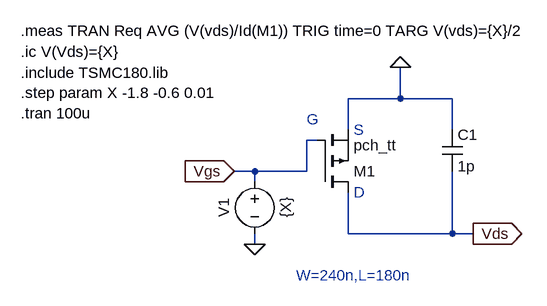
[diagram p0: schematic Prob_1b.asc]
Prob_1b.asc, the LTspice schematic file:
Version 4
SHEET 1 880 848
WIRE 32 560 32 512
WIRE 32 560 -48 560
WIRE 112 560 32 560
WIRE -48 608 -48 560
WIRE 112 608 112 560
WIRE -96 624 -112 624
WIRE -192 672 -224 672
WIRE -112 672 -112 624
WIRE -112 672 -192 672
WIRE -192 688 -192 672
WIRE -48 768 -48 704
WIRE 112 768 112 672
WIRE 112 768 -48 768
WIRE 144 768 112 768
WIRE -192 784 -192 768
FLAG -224 672 Vgs
IOPIN -224 672 In
FLAG -192 784 0
FLAG 32 512 0
FLAG 144 768 Vds
IOPIN 144 768 Out
SYMBOL voltage -192 672 R0
WINDOW 0 -32 56 VBottom 2
WINDOW 3 32 56 VTop 2
WINDOW 123 0 0 Left 0
WINDOW 39 0 0 Left 0
SYMATTR InstName V1
SYMATTR Value {X}
SYMBOL cap 96 608 R0
SYMATTR InstName C1
SYMATTR Value 1p
SYMBOL pmos -96 704 M180
SYMATTR InstName M1
SYMATTR Value pch_tt
SYMATTR Value2 W=240n, L=180n
TEXT -552 520 Left 2 !.include TSMC180.lib\n.step param X -1.8 -0.6 0.01\n.tran 100u
TEXT -552 488 Left 2 !.ic V(Vds)={X}
TEXT -552 456 Left 2 !.meas TRAN Req AVG (V(vds)/Id(M1)) TRIG time=0 TARG V(vds)={X}/2
TEXT -128 832 Left 2 ;W=240n,L=180n
TEXT -112 592 Left 2 ;G
TEXT -40 608 Left 2 ;S
TEXT -40 704 Left 2 ;D

The netlist it stands for:
* Prob_1b.asc
V1 Vgs 0 {X}
C1 0 Vds 1p
M1 Vds Vgs 0 0 pch_tt W=240n, L=180n
.model NMOS NMOS
.model PMOS PMOS
.lib standard.mos
.include TSMC180.lib
.step param X -1.8 -0.6 0.01
.tran 100u
.ic V(Vds)={X}
.meas TRAN Req AVG (V(vds)/Id(M1)) TRIG time=0 TARG V(vds)={X}/2
* W=240n,L=180n
* G
* S
* D
.backanno
.end

* Results of the author's LTspice run, read from the files saved beside the schematic
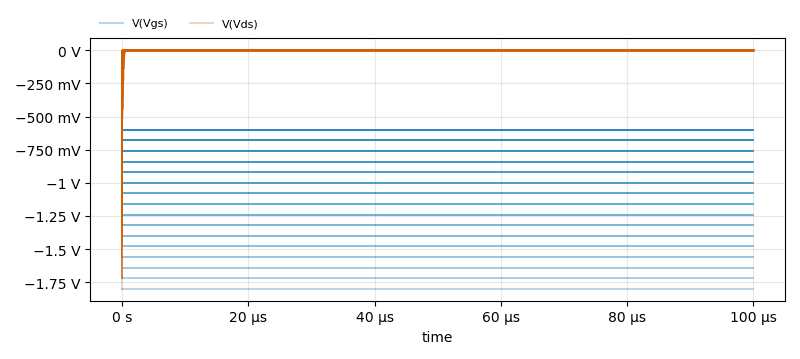
[diagram p1: Transient Analysis of Prob_1b.asc, plotted from the saved traces]
* Transient Analysis, 121 runs:
*   V(Vgs) [run 1]: min -1.8 V, max -1.8 V, average -1.8 V, rms 1.8 V, last -1.8 V
*   V(Vgs) [run 2]: min -1.72 V, max -1.72 V, average -1.72 V, rms 1.72 V, last -1.72 V
*   V(Vgs) [run 3]: min -1.64 V, max -1.64 V, average -1.64 V, rms 1.64 V, last -1.64 V
*   V(Vgs) [run 4]: min -1.56 V, max -1.56 V, average -1.56 V, rms 1.56 V, last -1.56 V
*   V(Vgs) [run 5]: min -1.48 V, max -1.48 V, average -1.48 V, rms 1.48 V, last -1.48 V
*   V(Vgs) [run 6]: min -1.4 V, max -1.4 V, average -1.4 V, rms 1.4 V, last -1.4 V
*   V(Vgs) [run 7]: min -1.32 V, max -1.32 V, average -1.32 V, rms 1.32 V, last -1.32 V
*   V(Vgs) [run 8]: min -1.24 V, max -1.24 V, average -1.24 V, rms 1.24 V, last -1.24 V
*   V(Vds) [run 1]: min -1.8 V, max 0 V, average -246.5 µV, rms 16.16 mV, last 0 V
*   V(Vds) [run 2]: min -1.72 V, max 0 V, average -250.3 µV, rms 15.97 mV, last 0 V
*   V(Vds) [run 3]: min -1.64 V, max 0 V, average -255.6 µV, rms 15.81 mV, last 0 V
*   V(Vds) [run 4]: min -1.56 V, max 0 V, average -260.5 µV, rms 15.57 mV, last 0 V
*   V(Vds) [run 5]: min -1.48 V, max 0 V, average -266.8 µV, rms 15.35 mV, last 0 V
*   V(Vds) [run 6]: min -1.4 V, max 0 V, average -275 µV, rms 15.17 mV, last 0 V
*   V(Vds) [run 7]: min -1.32 V, max 0 V, average -286.7 µV, rms 15.07 mV, last 0 V
*   V(Vds) [run 8]: min -1.24 V, max 0 V, average -302.3 µV, rms 15.04 mV, last 0 V
* From the log:
*   Measurement: req
*     step  AVG(v(vds)/id(m1))  FROM  TO
*        1  13754.1  0  2.36304e-008
*        2  13866.2  0  2.37518e-008
*        3  13980.8  0  2.3876e-008
*        4  14098.1  0  2.40032e-008
*        5  14218.1  0  2.41334e-008
*        6  14341  0  2.42666e-008
*        7  14466.8  0  2.44028e-008
*        8  14595.7  0  2.45419e-008
*        9  14727.8  0  2.46841e-008
*       10  14863.2  0  2.48293e-008
*       11  15002.1  0  2.49774e-008
*       12  15144.6  0  2.51285e-008
*       13  15414.4  0  2.53327e-008
*       14  15560.1  0  2.54709e-008
*       15  15635.8  0  2.56282e-008
*       16  15773.7  0  2.57751e-008
*       17  15914.1  0  2.59293e-008
*       18  16057.8  0  2.60875e-008
*       19  16204.9  0  2.62496e-008
*       20  16353.1  0  2.63818e-008
*       21  16507.4  0  2.65546e-008
*       22  16665.6  0  2.6732e-008
*       23  16827.6  0  2.69145e-008
*       24  16993.6  0  2.71022e-008
*       25  17163.7  0  2.72957e-008
*       26  17338.1  0  2.74953e-008
*       27  17517.2  0  2.77014e-008
*       28  17722.1  0  2.76856e-008
*       29  17913.9  0  2.78545e-008
*       30  18103.9  0  2.80655e-008
*       31  18309.8  0  2.82222e-008
*       32  18520.8  0  2.83847e-008
*       33  18737.3  0  2.85532e-008
*       34  18959.4  0  2.87276e-008
*       35  19187.4  0  2.89081e-008
*       36  19421.5  0  2.90948e-008
*       37  19661.8  0  2.92878e-008
*       38  19908.7  0  2.94873e-008
*       39  20162.3  0  2.96935e-008
*       40  20423.7  0  2.99107e-008
*     ...